# Altium schematic sheet MB_cpu_pwr.SchDoc: Материнская плата
size 420 x 297 mm; DrawnBy: В.Титов; DocumentNumber: ХХХХ.468179.001 Э3; SheetNumber: 2; SheetTotal: 4; DocumentType: Схема электрическая принципиальная; Title2: Питание процессора
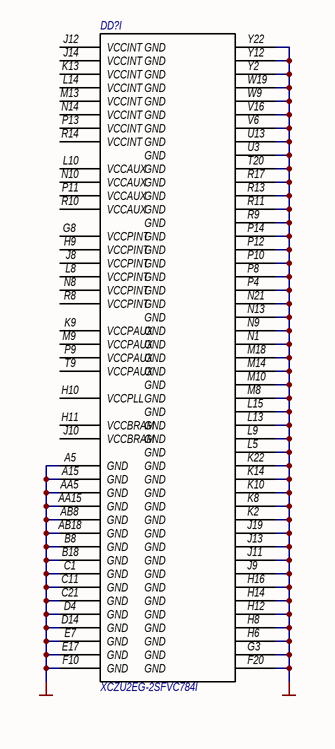
[diagram p0: MB_cpu_pwr.SchDoc]

## Parts
DD?  XCZU2EG-2SFVC784I  [BGA484C80P22X22_1900X1900X160]  (part I of 9)

## Nets
GND: DD?.A5(GND) DD?.A15(GND) DD?.AA5(GND) DD?.AA15(GND) DD?.AB8(GND) DD?.AB18(GND) DD?.B8(GND) DD?.B18(GND) DD?.C1(GND) DD?.C11(GND) DD?.C21(GND) DD?.D4(GND) DD?.D14(GND) DD?.E7(GND) DD?.E17(GND) DD?.F10(GND) DD?.F20(GND) DD?.G3(GND) DD?.H6(GND) DD?.H8(GND) DD?.H12(GND) DD?.H14(GND) DD?.H16(GND) DD?.J9(GND) DD?.J11(GND) DD?.J13(GND) DD?.J19(GND) DD?.K2(GND) DD?.K8(GND) DD?.K10(GND) DD?.K14(GND) DD?.K22(GND) DD?.L5(GND) DD?.L9(GND) DD?.L13(GND) DD?.L15(GND) DD?.M8(GND) DD?.M10(GND) DD?.M14(GND) DD?.M18(GND) DD?.N1(GND) DD?.N9(GND) DD?.N13(GND) DD?.N21(GND) DD?.P4(GND) DD?.P8(GND) DD?.P10(GND) DD?.P12(GND) DD?.P14(GND) DD?.R9(GND) DD?.R11(GND) DD?.R13(GND) DD?.R17(GND) DD?.T20(GND) DD?.U3(GND) DD?.U13(GND) DD?.V6(GND) DD?.V16(GND) DD?.W9(GND) DD?.W19(GND) DD?.Y2(GND) DD?.Y12(GND) DD?.Y22(GND)

Not connected (* = marked no-connect by the designer): DD? G8    (VCCPINT__________________) H9    (VCCPINT__________________) H10   (VCCPLL___________________) H11   (VCCBRAM__________________) J8    (VCCPINT__________________) J10   (VCCBRAM__________________) J12   (VCCINT___________________) J14   (VCCINT___________________) K9    (VCCPAUX__________________) K13   (VCCINT___________________) L8    (VCCPINT__________________) L10   (VCCAUX___________________) L14   (VCCINT___________________) M9    (VCCPAUX__________________) M13   (VCCINT___________________) N8    (VCCPINT__________________) N10   (VCCAUX___________________) N14   (VCCINT___________________) P9    (VCCPAUX__________________) P11   (VCCAUX___________________) P13   (VCCINT___________________) R8    (VCCPINT__________________) R10   (VCCAUX___________________) R14   (VCCINT___________________) T9    (VCCPAUX__________________)

## Notes on the sheet
- Перв. примен.
- Справ. №
- Подп. и дата
- Инв. № дубл.
- Взаим. инв. №
- Инв. № подл.
- Лист
- Изм.
- № докум.
- Подп.
- Дата
- Копировал
- Формат А3

## Library data of the parts
DD? = Микросхема XC7Z020-2CLG484I: Zynq®-7000 SoC Family; Manufacturer: XILINX; Value: XCZU2EG-2SFVC784I; ComponentLink1Description: datasheet; ComponentLink1URL: https://www.xilinx.com/support/documentation/data_sheets/ds925-zynq-ultrascale-plus.pdf